# EAGLE design breakout_mcp9804 (EAGLE 6.4)
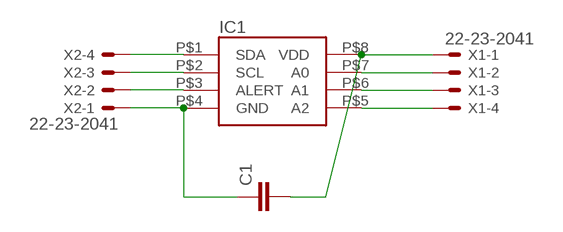
[diagram p0: schematic, sheet 1]

## Parts
C1  C-EUC1206  [C1206]
IC1  MPC9804  [MSOP-8]
X1  22-23-2041  [22-23-2041]
X2  22-23-2041  [22-23-2041]

## Nets
N$1: IC1.P$1(SDA) X2.4
N$2: IC1.P$2(SCL) X2.3
N$3: IC1.P$3(ALERT) X2.2
N$4: C1.1 IC1.P$4(GND) X2.1
N$5: C1.2 IC1.P$8(VDD) X1.1
N$6: IC1.P$7(A0) X1.2
N$7: IC1.P$6(A1) X1.3
N$8: IC1.P$5(A2) X1.4

## Library data of the parts
C1 = rcl:C-EU: CAPACITOR, European symbol
IC1 = MCP9804:MPC9804
X1 X2 = con-molex:22-23-2041: .100" (2.54mm) Center Header - 4 Pin; MF: MOLEX; MPN: 22-23-2041; OC_FARNELL: 1462920; OC_NEWARK: 38C0355

## Board
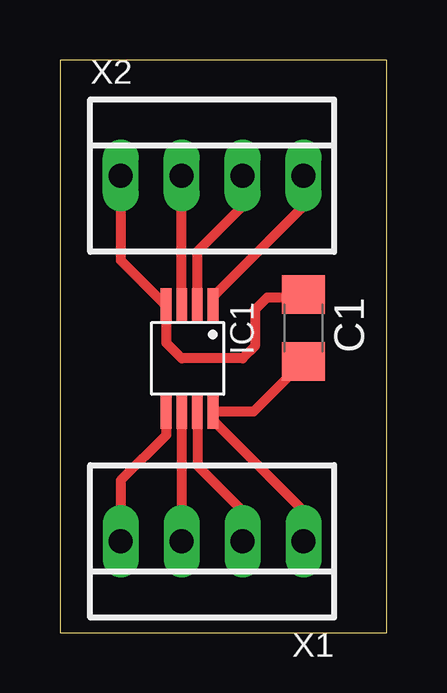
[diagram p1: board, top side]

Size 13.64 x 23.87 mm. Coordinates in mm from the lower left corner, seen from the top.
Outline: 0,0 13.64,0 13.64,23.87 0,23.87 0,0
Copper layers (1*16): Top 0.035mm / dielectric 1.5mm / Bottom 0.035mm
Design rules "default": minimum track width 10mil, minimum drill 24mil, track to track 8mil, track to pad 8mil, pad to pad 8mil, via to via 8mil, smd to smd 8mil, copper to edge 40mil, drill to drill 8mil, minimum pad ring 10mil, minimum via ring 8mil, stop-mask expansion 4mil, vias tented up to drill 0mil, thermal gap 10mil

### Footprints (pad centres in the part's own frame; a part is rotated, then mirrored left to right if it is on the bottom)
C1206 = smd 1.6 x 1.8: 1 -1.4,0; 2 1.4,0
MSOP-8 = smd 1.45 x 0.45: P$1 -2.2,1.3; P$2 -2.2,0.65; P$3 -2.2,0; P$4 -2.2,-0.65; P$5 2.2,-0.65; P$6 2.2,0; P$7 2.2,0.65; P$8 2.2,1.3
22-23-2041 = drill 1 long: 1 -3.81,0; 2 -1.27,0; 3 1.27,0; 4 3.81,0

### Placement (x,y rotation side)
C1  10.16,12.7 270 top
IC1  5.08,11.43 270 top
X1  6.35,3.81 180 top
X2  6.35,19.05 0 top

### Tracks (layer width: path | path; a pad name or v marks a point on that pad's centre or on a via)
N$1
  Top 0.406: IC1.P$1 6.38,14 10.16,17.78 X2.4
N$2
  Top 0.406: IC1.P$2 5.73,15.89 7.62,17.78 X2.3
N$3
  Top 0.406: IC1.P$3 X2.2
N$4
  Top 0.406: X2.1 2.54,15.52 IC1.P$4 4.43,12.08 5.08,11.43 7.62,11.43 8.13,11.94 8.13,13.46 8.64,13.97 10.16,13.97 C1.1
N$5
  Top 0.406: X1.1 10.16,5.08 6.38,8.86 IC1.P$8 8.09,9.23 C1.2
N$6
  Top 0.406: IC1.P$7 5.73,6.97 7.62,5.08 X1.2
N$7
  Top 0.406: IC1.P$6 X1.3
N$8
  Top 0.406: IC1.P$5 4.43,8.24 2.54,6.35 X1.4